# Altium project TAUV-Acoustic.PrjPcb
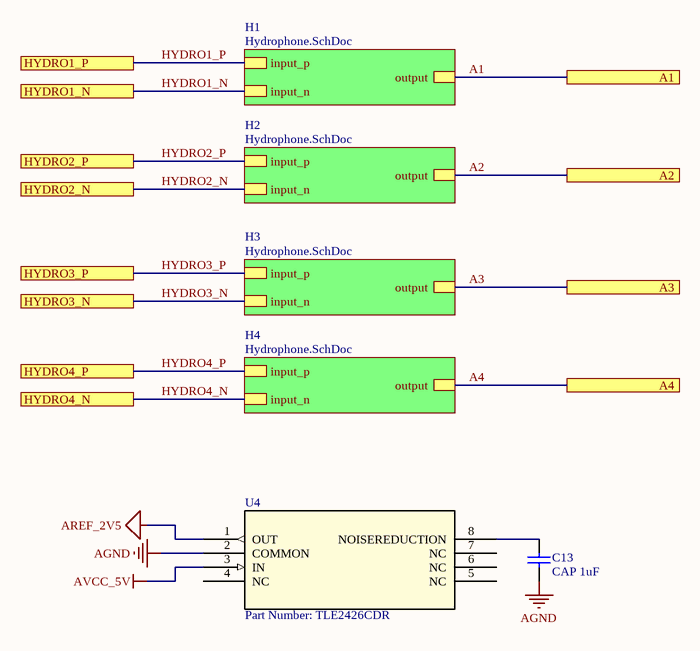
[diagram p0: Hydrophones.SchDoc]
3 sheets, 86 parts. Net scope: hierarchical (ports join the sheet entries above them; power ports are global).
Sheets:
  Hydrophones.SchDoc
    H2 = Hydrophone.SchDoc
    H3 = Hydrophone.SchDoc
    H4 = Hydrophone.SchDoc
    H1 = Hydrophone.SchDoc
  adc.SchDoc

## Sheet Hydrophones.SchDoc
size A; SheetNumber: 7

### Parts
C13  CAP 1uF  [CAPC0603(1608)100_N]
U4  Part Number: TLE2426CDR  [D8]

### Sub-sheets
H1 = Hydrophone.SchDoc: output, input_p, input_n
H2 = Hydrophone.SchDoc: output, input_p, input_n
H3 = Hydrophone.SchDoc: output, input_p, input_n
H4 = Hydrophone.SchDoc: output, input_p, input_n

### Ports
A1, A2, A3, A4, HYDRO1_N, HYDRO1_P, HYDRO2_N, HYDRO2_P, HYDRO3_N, HYDRO3_P, HYDRO4_N, HYDRO4_P

### Nets
AGND: C13.1 U4.2(COMMON)
AREF_2V5: U4.1(OUT)
AVCC_5V: U4.3(IN)
A1: port A1, sheet H1/output
A2: port A2, sheet H2/output
A3: port A3, sheet H3/output
A4: port A4, sheet H4/output
HYDRO1_N: port HYDRO1_N, sheet H1/input_n
HYDRO1_P: port HYDRO1_P, sheet H1/input_p
HYDRO2_N: port HYDRO2_N, sheet H2/input_n
HYDRO2_P: port HYDRO2_P, sheet H2/input_p
HYDRO3_N: port HYDRO3_N, sheet H3/input_n
HYDRO3_P: port HYDRO3_P, sheet H3/input_p
HYDRO4_N: port HYDRO4_N, sheet H4/input_n
HYDRO4_P: port HYDRO4_P, sheet H4/input_p
NetC13_2: C13.2 U4.8(NOISEREDUCTION)

Not connected (* = marked no-connect by the designer): U4 4(NC) 5(NC) 6(NC) 7(NC)

### Library data of the parts
C13 = CMP-1035-02736-1: CAP 1uF 16V ±5% 0603 (1608 Metric) Thickness 1mm SMD; Case-Metric: 1608; Case-EIA: 0603; Tolerance: Â±5%; Technology: SMT; Max Thickness: 1 mm; Rated Voltage: 16 V; Value: 1uF
U4 = TLE2426CDR: No Description Available; Vendor: Texas Instruments; Built_By: EMA_UL_Team; Manufacturer_Part_Number: TLE2426CDR; Copyright: Copyright (C) 2018 Accelerated Designs. All rights reserved; RefDes: RefDes; Type: DEV; Value: Value

## Sheet Hydrophone.SchDoc
size 508 x 241 mm
Used 4 times, as channels H2, H3, H4, H1. Parts and nets are listed once, with the designators drawn on the sheet.
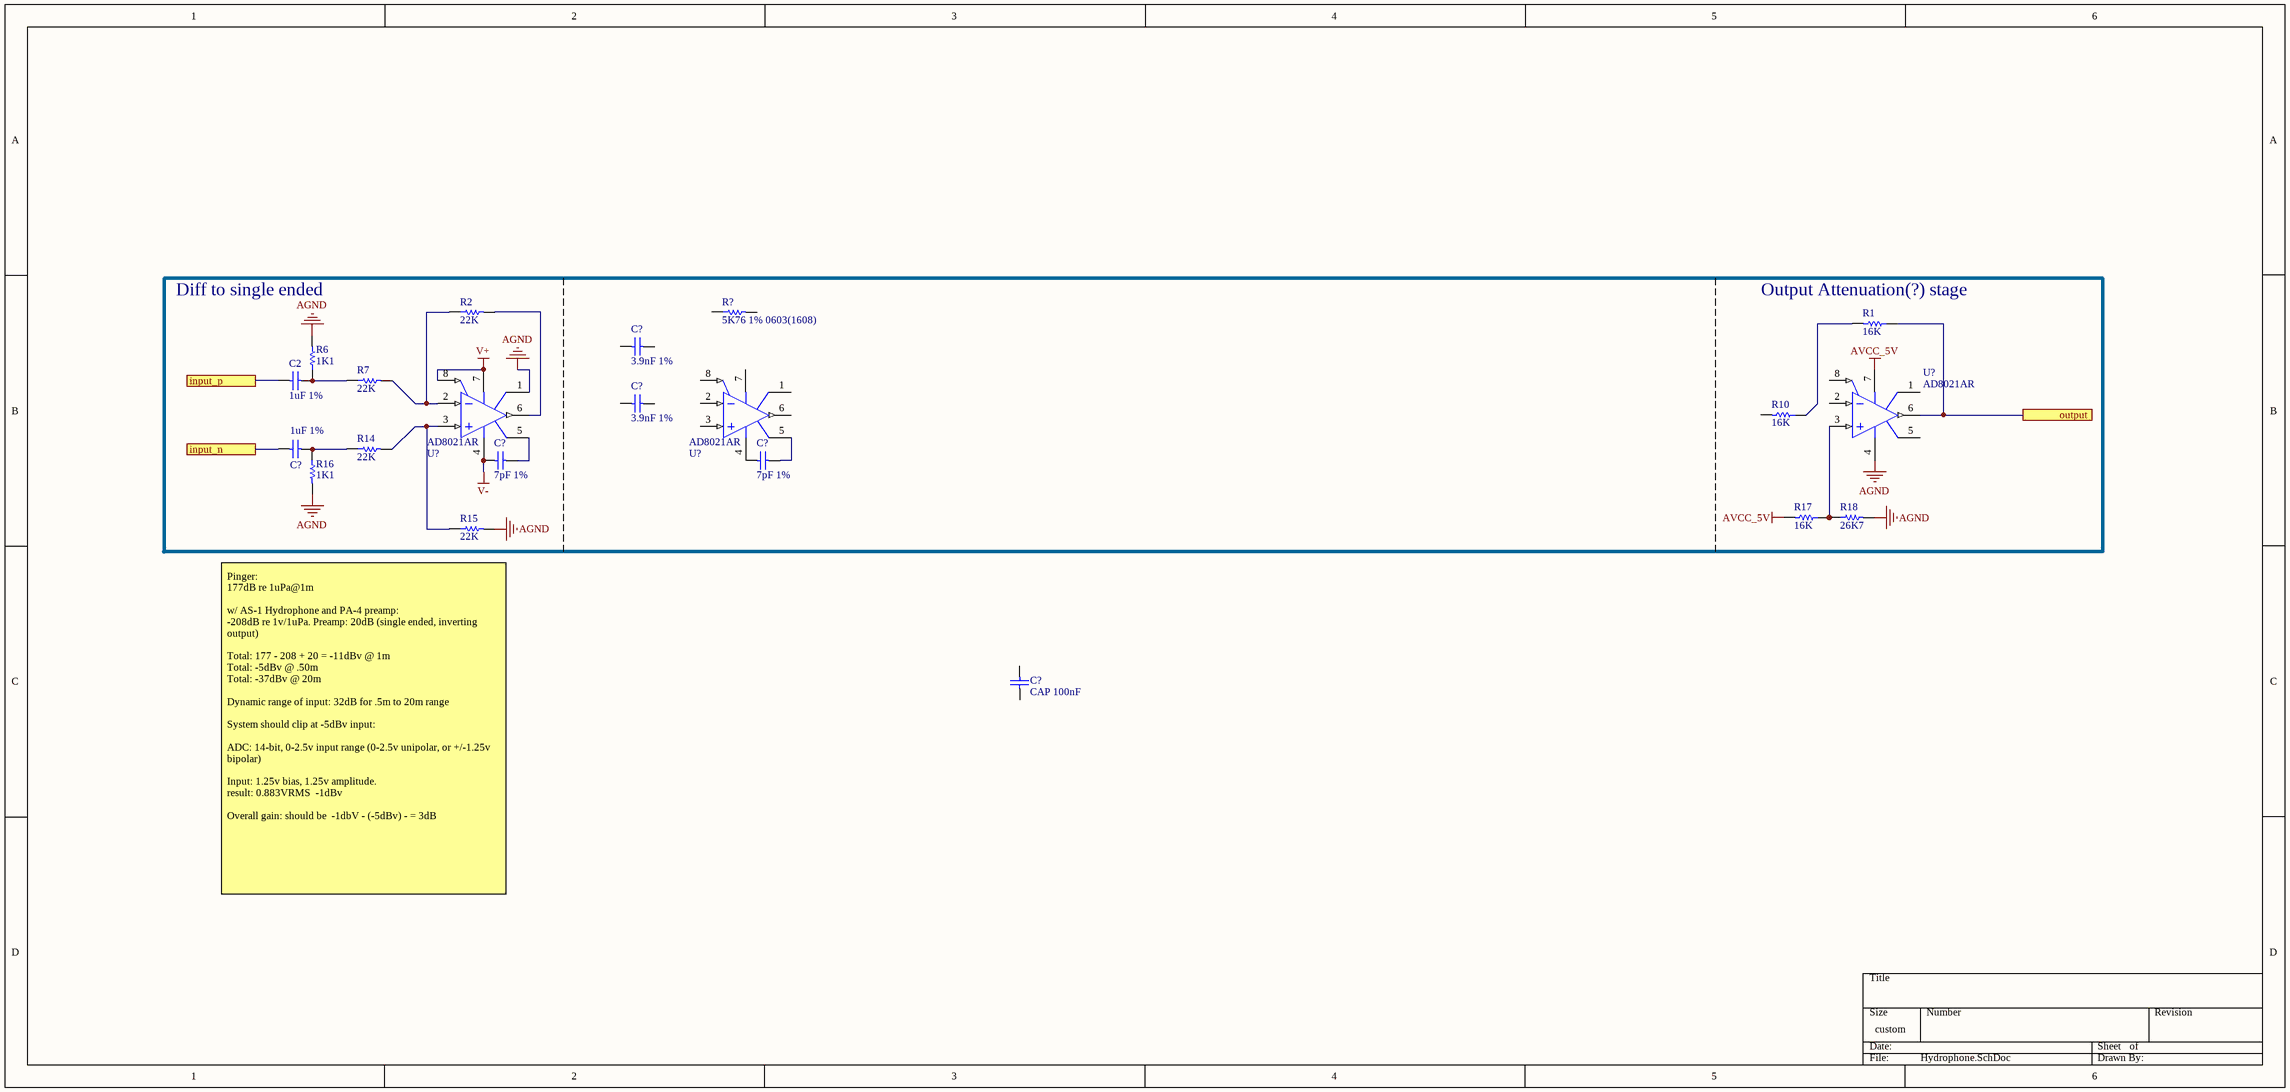
[diagram p1: Hydrophone.SchDoc]

### Parts
(Parts that share a designator on the sheet are numbered #1, #2 ... from top to bottom, then left to right.)
C2  1uF 1%  [CAPC0603(1608)100_N]
C?#1  3.9nF 1%  [CAPC0603(1608)100_L]
C?#2  3.9nF 1%  [CAPC0603(1608)100_L]
C?#3  1uF 1%  [CAPC0603(1608)100_N]
C?#4  7pF 1%  [CAPC0603(1608)100_L]
C?#5  7pF 1%  [CAPC0603(1608)100_L]
C?#6  CAP 100nF  [CAPC0603(1608)100_M]
R1  16K  [RESC0603(1608)_M]
R2  22K  [RESC0603(1608)_L]
R6  1K1  [RESC0603(1608)_N]
R7  22K  [RESC0603(1608)_L]
R10  16K  [RESC0603(1608)_M]
R14  22K  [RESC0603(1608)_L]
R15  22K  [RESC0603(1608)_L]
R16  1K1  [RESC0603(1608)_N]
R17  16K  [RESC0603(1608)_M]
R18  26K7  [RESC0603(1608)_N]
R?  5K76 1% 0603(1608)  [RESC0603(1608)_M]
U?#1  AD8021AR  [ADI-R-8_M]
U?#2  AD8021AR  [ADI-R-8_M]
U?#3  AD8021AR  [ADI-R-8_M]

### Ports
input_n, input_p, output

### Nets
AGND: R6.2 R15.2 R16.2 R18.2 U?#1.1(LOGIC_REFERENCE) U?#3.4(-VS)
AVCC_5V: R17.2 U?#3.7(+VS)
V+: U?#1.7(+VS) U?#1.8(~{DISABLE})
V-: C?#4.1 U?#1.4(-VS)
input_n: C?#3.1 ; port input_n
input_p: C2.1 ; port input_p
output: R1.1 U?#3.6(VOUT) ; port output
NetC2_2: C2.2 R6.1 R7.1
NetC?#3_2: C?#3.2 R14.1 R16.1
NetC?#4_2: C?#4.2 U?#1.5(CCOMP)
NetC?#5_1: C?#5.1 U?#2.4(-VS)
NetC?#5_2: C?#5.2 U?#2.5(CCOMP)
NetR1_2: R1.2 R10.1
NetR2_1: R2.1 R7.2 U?#1.2(-IN)
NetR2_2: R2.2 U?#1.6(VOUT)
NetR14_2: R14.2 R15.1 U?#1.3(+IN)
NetR17_1: R17.1 R18.1 U?#3.3(+IN)

Not connected (* = marked no-connect by the designer): C?#1 1 2; C?#2 1 2; C?#6 1 2; R10 2; R? 1 2; U?#2 1(LOGIC_REFERENCE) 2(-IN) 3(+IN) 6(VOUT) 7(+VS) 8(~{DISABLE}); U?#3 1(LOGIC_REFERENCE) 2(-IN) 5(CCOMP) 8(~{DISABLE})

### Channels
H2: designators C2=C2_H2 C?=C?_H2#6 C?=C?_H2#4 C?=C?_H2#2 C?=C?_H2#3 C?=C?_H2#1 C?=C?_H2#5 R1=R1_H2 R2=R2_H2 R6=R6_H2 R7=R7_H2 R10=R10_H2 R14=R14_H2 R15=R15_H2 R16=R16_H2 R17=R17_H2 R18=R18_H2 R?=R?_H2 U?=U?_H2#3 U?=U?_H2#1 U?=U?_H2#2; ports input_n=HYDRO2_N input_p=HYDRO2_P output=A2
H3: designators C2=C2_H3 C?=C?_H3#6 C?=C?_H3#4 C?=C?_H3#2 C?=C?_H3#3 C?=C?_H3#1 C?=C?_H3#5 R1=R1_H3 R2=R2_H3 R6=R6_H3 R7=R7_H3 R10=R10_H3 R14=R14_H3 R15=R15_H3 R16=R16_H3 R17=R17_H3 R18=R18_H3 R?=R?_H3 U?=U?_H3#3 U?=U?_H3#1 U?=U?_H3#2; ports input_n=HYDRO3_N input_p=HYDRO3_P output=A3
H4: designators C2=C2_H4 C?=C?_H4#6 C?=C?_H4#4 C?=C?_H4#2 C?=C?_H4#3 C?=C?_H4#1 C?=C?_H4#5 R1=R1_H4 R2=R2_H4 R6=R6_H4 R7=R7_H4 R10=R10_H4 R14=R14_H4 R15=R15_H4 R16=R16_H4 R17=R17_H4 R18=R18_H4 R?=R?_H4 U?=U?_H4#3 U?=U?_H4#1 U?=U?_H4#2; ports input_n=HYDRO4_N input_p=HYDRO4_P output=A4
H1: designators C2=C2_H1 C?=C?_H1#6 C?=C?_H1#4 C?=C?_H1#2 C?=C?_H1#3 C?=C?_H1#1 C?=C?_H1#5 R1=R1_H1 R2=R2_H1 R6=R6_H1 R7=R7_H1 R10=R10_H1 R14=R14_H1 R15=R15_H1 R16=R16_H1 R17=R17_H1 R18=R18_H1 R?=R?_H1 U?=U?_H1#3 U?=U?_H1#1 U?=U?_H1#2; ports input_n=HYDRO1_N input_p=HYDRO1_P output=A1

### Notes on the sheet
- Diff to single ended
- (near R1) Output Attenuation(?) stage
- (near R15) Pinger:
  177dB re 1uPa@1m
  w/ AS-1 Hydrophone and PA-4 preamp:
  -208dB re 1v/1uPa. Preamp: 20dB (single ended, inverting output)
  Total: 177 - 208 + 20 = -11dBv @ 1m
  Total: -5dBv @ .50m
  Total: -37dBv @ 20m
  Dynamic range of input: 32dB for .5m to 20m range
  System should clip at -5dBv input:
  ADC: 14-bit, 0-2.5v input range (0-2.5v unipolar, or +/-1.25v bipolar)
  Input: 1.25v bias, 1.25v amplitude.
  result: 0.883VRMS  -1dBv
  Overall gain: should be  -1dbV - (-5dBv) - = 3dB

### Library data of the parts
C2 C?#3 = CMP-1035-02736-1: as C13 on sheet Hydrophones; Technology: SMT; Max Thickness: 1 mm; Rated Voltage: 16 V; Value: 1uF
C?#1 C?#2 = CMP-1035-02156-1: CAP 3.9nF 25V ±1% 0603 (1608 Metric) Thickness 1mm SMD; Tolerance: Â±1%; Case-EIA: 0603; Case-Metric: 1608; Max Thickness: 1 mm; Value: 3.9nF; Rated Voltage: 25 V; Technology: SMT
C?#4 C?#5 = CMP-1035-00450-1: CAP 7pF 50V ±0.5pF 0603 (1608 Metric) Thickness 1mm SMD; Tolerance: Â±0.5pF; Case-EIA: 0603; Case-Metric: 1608; Max Thickness: 1 mm; Technology: SMT; Value: 7pF; Rated Voltage: 50 V
C?#6 = CMP-1035-02583-1: CAP 100nF 16V ±5% 0603 (1608 Metric) Thickness 1mm SMD; Tolerance: Â±5%; Case-Metric: 1608; Case-EIA: 0603; Rated Voltage: 16 V; Max Thickness: 1 mm; Technology: SMT; Value: 100nF
R1 R10 R17 = CMP-1012-00644-1: 16K 0.1W 1% 0603 (1608 Metric)  SMD; Value: 16000.00 Ohm; Case-Metric: 1608; Case-EIA: 0603; Technology: SMT; Tolerance: 1 %; Power: 0.1 W
R2 R7 R14 R15 = CMP-1012-00659-1: 22K 0.1W 1% 0603 (1608 Metric)  SMD; Case-EIA: 0603; Value: 22000.00 Ohm; Case-Metric: 1608; Technology: SMT; Power: 0.1 W; Tolerance: 1 %
R6 R16 = CMP-1012-00514-1: 1K1 0.1W 1% 0603 (1608 Metric)  SMD; Case-Metric: 1608; Case-EIA: 0603; Value: 1100.00 Ohm; Technology: SMT; Tolerance: 1 %; Power: 0.1 W
R18 = CMP-1012-00669-1: 26K7 0.1W 1% 0603 (1608 Metric)  SMD; Value: 26700.00 Ohm; Case-Metric: 1608; Case-EIA: 0603; Power: 0.1 W; Technology: SMT; Tolerance: 1 %
R? = CMP-1012-00596-1: 5K76 0.1W 1% 0603 (1608 Metric)  SMD; Case-EIA: 0603; Case-Metric: 1608; Value: 5760.00 Ohm; Tolerance: 1 %; Power: 0.1 W; Technology: SMT
U?#1-U?#3 = CMP-0384-00643-2: Single Channel Low Power Operational Amplifier, 490 MHz BW, 120 V/us SR, Industrial, 8-pin SOIC (R-8), Tube; Generic Part Number: AD8021; Manufacturer: Analog Devices; Input Bias Current: 7.5uA; Iq/Amp: 7.7mA; Input Offset Voltage: 400uV; Small Signal Bandwidth: 490MHz; V Span Min: 4.5V; V Span Max: 24V; Amplifiers Per Package: 1; ComponentLink4URL: http://www.analog.com/en/all-operational-amplifiers-op-amps/operational-amplifiers-op-amps/ad8021/products/product.html#product-recommendations; ComponentLink3URL: http://www.analog.com/static/imported-files/packages/PKG_PDF/SOIC_Narrow%20(R)/R_8.pdf; PackageDescription: 8-Pin Standard Small Outline Package, Body 3.9 x 4.9 mm, Pitch 1.27 mm; Slew Rate: 120V/us; PackageVersion: 060506-A; ComponentLink4Description: Reference Circuit; PartNumber: AD8021AR; ComponentLink1Description: Manufacturer URL; Code_JEDEC: MS-012-AA; RevisionNote: Reference Circuit URL fixed; ComponentLink3Description: Package Specification; PackageReference: R-8; DatasheetVersion: Rev. F; ComponentLink1URL: http://www.analog.com/en/index.html; Mounting Technology: Surface Mount; ComponentLink2Description: Datasheet; ComponentLink2URL: http://www.analog.com/static/imported-files/data_sheets/AD8021.pdf

## Sheet adc.SchDoc
size A

## Nets that join several sheets
AGND: Hydrophones (C13.1 U4.2), H2 (6 pins), H3 (6 pins), H4 (6 pins), H1 (6 pins)
AVCC_5V: Hydrophones (U4.3), H2 (R17_H2.2 U?_H2#3.7), H3 (R17_H3.2 U?_H3#3.7), H4 (R17_H4.2 U?_H4#3.7), H1 (R17_H1.2 U?_H1#3.7)
V+: H2 (U?_H2#1.7 U?_H2#1.8), H3 (U?_H3#1.7 U?_H3#1.8), H4 (U?_H4#1.7 U?_H4#1.8), H1 (U?_H1#1.7 U?_H1#1.8)
V-: H2 (C?_H2#4.1 U?_H2#1.4), H3 (C?_H3#4.1 U?_H3#1.4), H4 (C?_H4#4.1 U?_H4#1.4), H1 (C?_H1#4.1 U?_H1#1.4)